# Altium schematic sheet Power Stage.SchDoc
size A
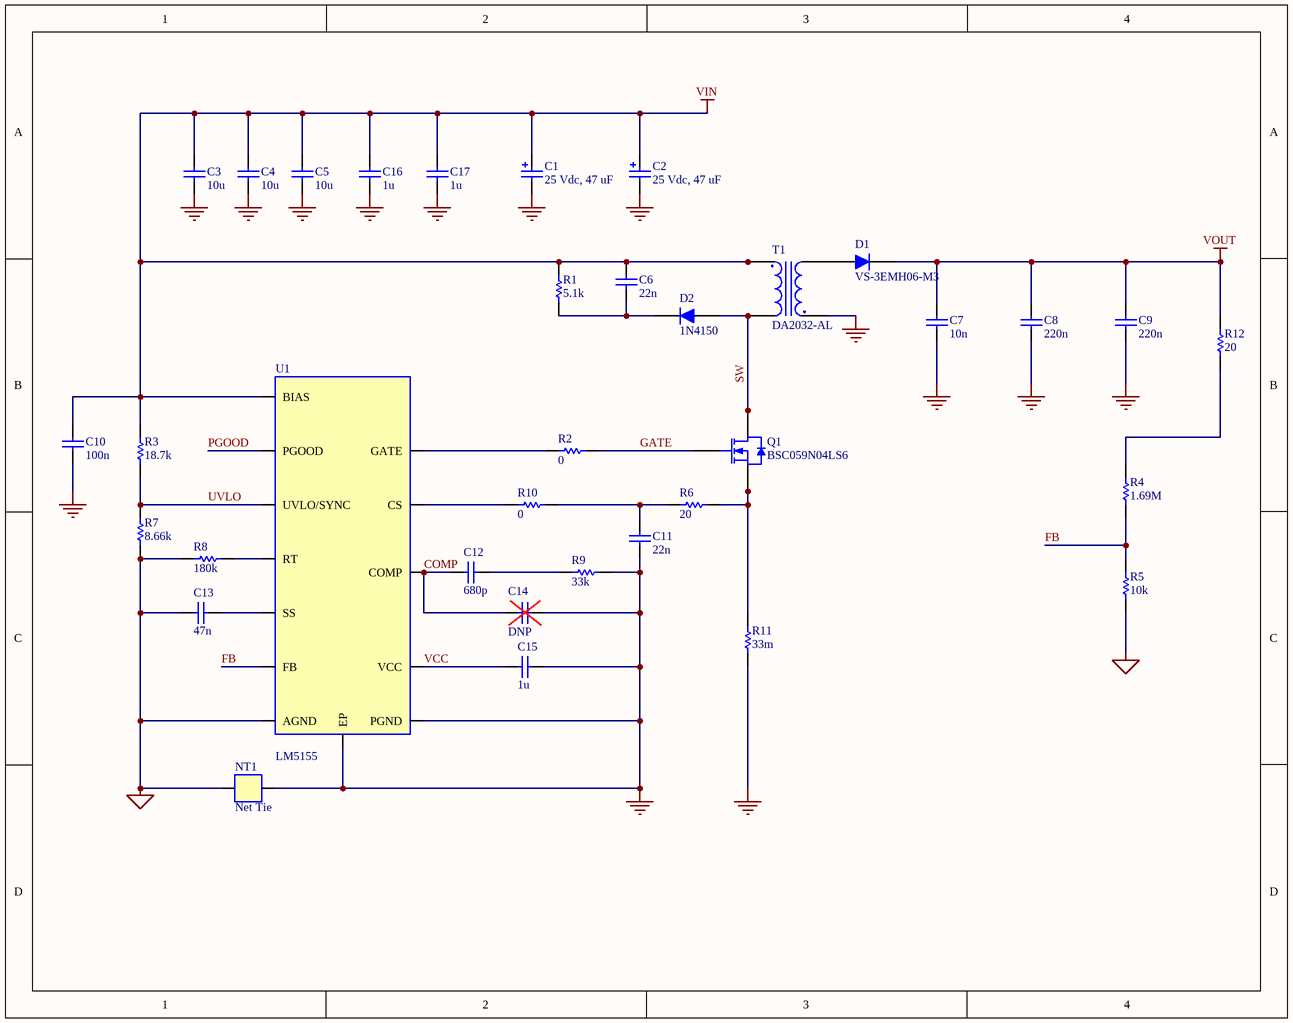
[diagram p0: Power Stage.SchDoc]

## Parts
C1  25 Vdc, 47 uF  [WCAP-PTG5_8x8x3.5]
C2  25 Vdc, 47 uF  [WCAP-PTG5_8x8x3.5]
C3  10u  [CAPC1210(3225)280_N]
C4  10u  [CAPC1210(3225)280_N]
C5  10u  [CAPC1210(3225)280_N]
C6  22n  [CAPC0805(2012)100_M]
C7  10n  [CAPC1206(3216)170_M]
C8  220n  [WIMA 6x12x13]
C9  220n  [WIMA 6x12x13]
C10  100n  [CAPC0603(1608)100_N]
C11  22n  [CAPC0603(1608)100_N]
C12  680p  [CAPC0603(1608)100_M]
C13  47n  [CAPC0603(1608)100_N]
C14  DNP  [CAPC0603(1608)100_M]  (no BOM)
C15  1u  [CAPC0603(1608)100_L]
C16  1u  [CAPC0805(2012)145_N]
C17  1u  [CAPC0805(2012)145_N]
D1  VS-3EMH06-M3  [SMA DO-214AC]
D2  1N4150  [SOD123]
NT1  Net Tie  [NET TIE .25mm]  (net tie, no BOM)
Q1  BSC059N04LS6  [PG-TDSON-8]
R1  5.1k  [RESC1210(3225)_M]
R2  0  [RESC0603(1608)_M]
R3  18.7k  [RESC0603(1608)_N]
R4  1.69M  [RESC0603(1608)_N]
R5  10k  [RESC0603(1608)_N]
R6  20  [RESC0603(1608)_N]
R7  8.66k  [RESC0603(1608)_N]
R8  180k  [RESC0603(1608)_N]
R9  33k  [RESC0603(1608)_M]
R10  0  [RESC0603(1608)_M]
R11  33m  [RESC1206(3216)_N]
R12  20  [RESC0603(1608)_M]
T1  DA2032-AL  [DA2032-AL]
U1  LM5155  [WSON-12]

## Nets
AGND: C13.2 NT1.1 R5.2 R7.1 R8.1 U1.7(AGND)
GND: C1.2(N) C2.2(N) C3.1 C4.1 C5.1 C7.1 C8.1 C9.1 C10.1 C11.1 C14.2 C15.1 C16.1 C17.1 NT1.2 R9.2 R11.1 T1.12 U1.4(PGND) U1.13(EP)
VIN: C1.1(P) C2.1(P) C3.2 C4.2 C5.2 C6.2 C10.2 C16.2 C17.2 R1.2 R3.2 T1.3 T1.4 T1.5 T1.6 U1.1(BIAS)
VOUT: C7.2 C8.2 C9.2 D1.2(K) R12.2
COMP: C12.1 C14.1 U1.6(COMP)
FB: R4.2 R5.1 U1.8(FB)
GATE: Q1.4(GATE) R2.2
PGOOD: U1.11(PGOOD)
SW: D2.1(A) Q1.5(DRAIN) Q1.6(DRAIN) Q1.7(DRAIN) Q1.8(DRAIN) T1.7 T1.8 T1.9 T1.10
UVLO: R3.1 R7.2 U1.12(UVLO/SYNC)
VCC: C15.2 U1.2(VCC)
NetC6_1: C6.1 D2.2(K) R1.1
NetC11_2: C11.2 R6.1 R10.2
NetC12_2: C12.2 R9.1
NetC13_1: C13.1 U1.9(SS)
NetD1_1: D1.1(A) T1.1
NetQ1_1: Q1.1(SOURCE) Q1.2(SOURCE) Q1.3(SOURCE) R6.2 R11.2
NetR2_1: R2.1 U1.3(GATE)
NetR4_1: R4.1 R12.1
NetR8_2: R8.2 U1.10(RT)
NetR10_1: R10.1 U1.5(CS)

## Library data of the parts
C1 C2 = 870025574002: WCAP-PTG5 Aluminum Polymer Capacitors, 8x8mm, 25 Vdc, 47 uF; Rated Voltage: 25 Vdc; Value: 47 uF; ComponentLink1Description: Manufacturer; ComponentLink1URL: http://www.we-online.de; ComponentLink2Description: Datasheet; ComponentLink2URL: http://katalog.we-online.com/pbs/datasheet/870025574002.pdf; Part Number: 870025574002; Published Date: Sep. 2017; Publisher: Wurth Elektronik; Size: 8x8mm; Life Cycle: 2000h; Operating Temperature: -55 °C up to +105 °C; Supplier 1: Digi-Key; Supplier Part Number 1: 732-6324-1-ND; Supplier 2: Mouser; Supplier Part Number 2: 710-870025574002
C3-C5 = CL32B106KBJNNWE: CAP CER 10UF 50V X7R 1210; Manufacturer: Samsung; Tolerance: 10%; Supplier 1: Digi-Key; Manufacturer Part Number: CL32B106KBJNNWE; Stock 1: 279648; Pricing 1: 1=0.69, 10=0.488, 100=0.3214, 500=0.23804 (USD); Mount: Surface Mount; Case/Package: 1210; Case Code (Metric): 3225; Case Code (Imperial): 1210; Min Operating Temperature: -55°C; Max Operating Temperature: 125°C; Capacitance: 10uF; Voltage Rating: 50V; Package Quantity: 1; Packaging: Tape and Reel; Dielectric: X7R; Length: 0.126inch; Width: 0.098inch; Thickness: 0.106inch; Lead Free: Lead Free; ComponentLink1URL: http://www.samsungsem.com/kr/support/product-search/mlcc/CL32B106KBJNNWE.jsp?src-supplier=Digi-Key; ComponentLink1Description: http://www.samsungsem.com/kr/support/product-search/mlcc/CL32B106KBJNNWE.jsp?src-supplier=Digi-Key; Supplier Part Number 1: 1276-3388-1-ND
C6 = CC0805KRX7R0BB223: CAP CER 0.022UF 100V X7R 0805; Manufacturer: Yageo; Capacitance: 22nF; Tolerance: 10%; Supplier 1: Digi-Key; Manufacturer Part Number: CC0805KRX7R0BB223; Stock 1: 2263; Pricing 1: 1=0.13, 10=0.09, 100=0.0425, 500=0.02982, 1000=0.02469 (USD); Mount: Surface Mount; Case/Package: 0805; Min Operating Temperature: -55°C; Max Operating Temperature: 125°C; Dielectric: X7R; Packaging: Tape and Reel; Voltage Rating: 100V; Length: 2mm; Depth: 1.25mm; Width: 1.25mm; Thickness: 0.037inch; ComponentLink1URL: http://documents.rs-components.com/techlib://itc_doclist_GB.htm?stockno=6698886&src-supplier=RSComponents; ComponentLink1Description: http://documents.rs-components.com/techlib://itc_doclist_GB.htm?stockno=6698886&src-supplier=RSComponents; ComponentLink2URL: http://www.farnell.com/datasheets/1447671.pdf?src-supplier=Element14; ComponentLink2Description: http://www.farnell.com/datasheets/1447671.pdf?src-supplier=Element14; Supplier 2: Mouser; Supplier Part Number 1: 311-1473-1-ND; Supplier Part Number 2: 603-CC805KRX7R0BB223; Weight: 0.000194oz; Case Code (Imperial): 0805; Case Code (Metric): 2012; Package Quantity: 1; Voltage Rating (DC): 100V; Termination: SMD/SMT; Composition: Ceramic; Voltage: 100V; Height: 0.85mm; Radiation Hardening: No; REACH SVHC: Unknown; Lead Free: Lead Free; ComponentLink3URL: http://www.yageo.com/documents/recent/UPY-NP0X7R_MV_100-to-630V_9.pdf?src-supplier=Future+Electronics; ComponentLink3Description: http://www.yageo.com/documents/recent/UPY-NP0X7R_MV_100-to-630V_9.pdf?src-supplier=Future+Electronics; ComponentLink4URL: https://www.verical.com/server-webapp/html/getDatasheet?partID=251804&src-supplier=Verical; ComponentLink4Description: https://www.verical.com/server-webapp/html/getDatasheet?partID=251804&src-supplier=Verical; ComponentLink5URL: http://www.yageo.com/documents/recent/UPY-NP0X7R_MV_100-to-630V_21.pdf?src-supplier=Digi-Key; ComponentLink5Description: http://www.yageo.com/documents/recent/UPY-NP0X7R_MV_100-to-630V_21.pdf?src-supplier=Digi-Key; ComponentLink6URL: http://www.yageo.com/documents/recent/UPY-NP0X7R_MV_100-to-630V_9.pdf?src-supplier=Avnet; ComponentLink6Description: http://www.yageo.com/documents/recent/UPY-NP0X7R_MV_100-to-630V_9.pdf?src-supplier=Avnet; Stock 2: 8175; Pricing 2: 1=0.13, 10=0.064, 100=0.029, 1000=0.024, 4000=0.017, 8000=0.017 (USD)
C7 = C3216C0G2E103J115AE: CAP CER 10000PF 250V C0GNP0 1206; Manufacturer: TDK; Supplier 1: Digi-Key; Manufacturer Part Number: C3216C0G2E103J115AE; Stock 1: 9927; Pricing 1: 1=0.54, 10=0.38, 100=0.25, 500=0.18516, 1000=0.15738 (USD); Supplier 2: Mouser; Supplier Part Number 1: 445-180311-1-ND; Supplier Part Number 2: 810-C3216C0G2E103J11
C8 C9 = MKP4F032203G00KSSD: Film Capacitors 250V .22uF 10% PCM10; Manufacturer: WIMA; Voltage Rating (AC): 160V; Capacitance: 220nF; Dielectric: PP; Type: General Purpose; Lead Diameter: 0.6mm; Supplier 1: Mouser; Manufacturer Part Number: MKP4F032203G00KSSD; Stock 1: 4238; Pricing 1: 1=0.7, 10=0.502, 100=0.331, 500=0.245, 1000=0.208, 2500=0.196 (USD); Case/Package: Radial; Min Operating Temperature: -55°C; Max Operating Temperature: 100°C; Voltage Rating: 250V; Voltage Rating (DC): 250V; Tolerance: 10%; Packaging: Bulk; Termination: Radial; Dissipation Factor: 10%; Length: 13mm; Height: 12mm; Width: 6mm; Lead Pitch: 10mm; Depth: 6mm; ComponentLink1URL: http://components.arrow.com/part/dataview/0323_02831910?src-supplier=Arrow+Europe; ComponentLink1Description: http://components.arrow.com/part/dataview/0323_02831910?src-supplier=Arrow+Europe; ComponentLink2URL: http://www.mouser.com/ds/2/440/WIMA_MKP_4-9504.pdf?src-supplier=Mouser; ComponentLink2Description: http://www.mouser.com/ds/2/440/WIMA_MKP_4-9504.pdf?src-supplier=Mouser; Supplier Part Number 1: 505-MKP4.22/250/10
C10 = CC0603JRX7R9BB104: Cap Ceramic 0.1uF 50V X7R 5% SMD 0603 125C Paper T/R; Manufacturer: Yageo; Capacitance: 100nF; Supplier 1: Digi-Key; Manufacturer Part Number: CC0603JRX7R9BB104; Stock 1: 1420595; Pricing 1: 1=0.11, 10=0.08, 100=0.0378, 500=0.02652, 1000=0.02195 (USD); Mount: Surface Mount; Case/Package: 0603; Number of Pins: 2; Weight: 7.1E-05oz; Case Code (Imperial): 0603; Case Code (Metric): 1608; Min Operating Temperature: -55°C; Max Operating Temperature: 125°C; Voltage Rating: 50V; Tolerance: 5%; Packaging: Tape and Reel; Voltage Rating (DC): 50V; Dielectric: X7R; Termination: SMD/SMT; Composition: Ceramic; Length: 1.6mm; Height: 0.8mm; Width: 0.031inch; Thickness: 0.035inch; Depth: 0.8mm; Radiation Hardening: No; Lead Free: Lead Free; Halogen Free: Halogen Free; ComponentLink1URL: http://www.yageo.com/documents/recent/UPY-GPHC_X7R_6.3V-to-50V_8.pdf?src-supplier=Avnet+Europe; ComponentLink1Description: http://www.yageo.com/documents/recent/UPY-GPHC_X7R_6.3V-to-50V_8.pdf?src-supplier=Avnet+Europe; ComponentLink2URL: http://www.yageo.com/documents/recent/UPY-GPHC_X7R_6.3V-to-50V_8.pdf?src-supplier=Avnet; ComponentLink2Description: http://www.yageo.com/documents/recent/UPY-GPHC_X7R_6.3V-to-50V_8.pdf?src-supplier=Avnet; Supplier 2: Mouser; Supplier Part Number 2: 603-CC603JRX7R9BB104; Supplier Part Number 1: 311-1779-1-ND
C11 = C0603C223K4RACTU: Cap Ceramic 0.022uF 16V X7R 10% SMD 0603 125°C Paper T/R; Manufacturer: KEMET; Capacitance: 22nF; Supplier 1: Digi-Key; Manufacturer Part Number: C0603C223K4RACTU; Stock 1: 100470; Pricing 1: 1=0.1, 10=0.07, 100=0.031, 500=0.02214, 1000=0.01739 (USD); Mount: Surface Mount; Case/Package: 0603; Case Code (Metric): 1608; Case Code (Imperial): 0603; Min Operating Temperature: -55°C; Max Operating Temperature: 125°C; Packaging: Tape and Reel; Package Quantity: 1; Voltage Rating: 16V; Tolerance: 10%; Voltage Rating (DC): 16V; Dielectric: X7R; Termination: SMD/SMT; Length: 1.6mm; Height: 0.8mm; Width: 0.8mm; Thickness: 0.034inch; REACH SVHC: No SVHC; ComponentLink1URL: https://search.kemet.com/component-edge/download/datasheet/C0603C223K4RACTU.pdf?src-supplier=Allied+Electronics; ComponentLink1Description: https://search.kemet.com/component-edge/download/datasheet/C0603C223K4RACTU.pdf?src-supplier=Allied+Electronics; ComponentLink2URL: http://www.jameco.com/Jameco/Products/ProdDS/1636924.pdf?src-supplier=Jameco; ComponentLink2Description: http://www.jameco.com/Jameco/Products/ProdDS/1636924.pdf?src-supplier=Jameco; Supplier 2: Mouser; Stock 2: 254178; Pricing 2: 1=0.1, 10=0.032, 100=0.022, 500=0.019, 1000=0.015, 4000=0.011 (USD); Supplier Part Number 2: 80-C0603C223K4R; Supplier Part Number 1: 399-1093-1-ND; Weight: 7.1E-05oz; Depth: 0.8mm; Radiation Hardening: No; ComponentLink3URL: https://www.verical.com/server-webapp/html/getDatasheet?partID=724406&src-supplier=Verical; ComponentLink3Description: https://www.verical.com/server-webapp/html/getDatasheet?partID=724406&src-supplier=Verical
C12 = 885012006013: Cap, Mlcc, C0g, 680Pf, 10V, 0603; Manufacturer: Wurth Electronics; Tolerance: 5%; Supplier 1: Digi-Key; Manufacturer Part Number: 885012006013; Stock 1: 4565; Pricing 1: 1=0.1, 10=0.056, 100=0.0506, 500=0.04476 (USD); Mount: Surface Mount; Case/Package: 0603; Case Code (Imperial): 0603; Case Code (Metric): 1608; Min Operating Temperature: -55°C; Max Operating Temperature: 125°C; Capacitance: 680pF; Voltage Rating: 10V; Packaging: Tape and Reel; Length: 0.063inch; Width: 0.031inch; Thickness: 0.034inch; ComponentLink1URL: https://katalog.we-online.de/pbs/datasheet/885012006013.pdf?src-supplier=Digi-Key; ComponentLink1Description: https://katalog.we-online.de/pbs/datasheet/885012006013.pdf?src-supplier=Digi-Key; ComponentLink2URL: http://www.farnell.com/datasheets/2546580.pdf?src-supplier=Farnell; ComponentLink2Description: http://www.farnell.com/datasheets/2546580.pdf?src-supplier=Farnell; Supplier 2: Mouser; Stock 2: 3118; Pricing 2: 1=0.1, 10=0.057, 25=0.057, 50=0.057, 100=0.051, 250=0.051 (USD); Supplier Part Number 1: 732-7757-1-ND; Supplier Part Number 2: 710-885012006013
C13 = CC0603KRX7R9BB473: CAP CER 0.047UF 50V X7R 0603; Manufacturer: Yageo; Capacitance: 47nF; Tolerance: 10%; Supplier 1: Digi-Key; Manufacturer Part Number: CC0603KRX7R9BB473; Stock 1: 536094; Pricing 1: 1=0.1, 10=0.052, 100=0.0234, 500=0.0167, 1000=0.01312 (USD); Mount: Surface Mount; Case/Package: 0603; Case Code (Metric): 1608; Case Code (Imperial): 0603; Min Operating Temperature: -55°C; Max Operating Temperature: 125°C; Package Quantity: 1; Voltage Rating: 50V; Packaging: Tape and Reel; Voltage Rating (DC): 50V; Dielectric: X7R; Termination: SMD/SMT; Composition: Ceramic; Voltage: 50V; Length: 1.6mm; Height: 0.8mm; Width: 0.031inch; Thickness: 0.035inch; Depth: 0.8mm; Radiation Hardening: No; REACH SVHC: Unknown; Lead Free: Lead Free; Halogen Free: Halogen Free; ComponentLink1URL: http://www.yageo.com/documents/recent/UPY-GPHC_X7R_6.3V-to-50V_18.pdf?src-supplier=Digi-Key; ComponentLink1Description: http://www.yageo.com/documents/recent/UPY-GPHC_X7R_6.3V-to-50V_18.pdf?src-supplier=Digi-Key; ComponentLink2URL: http://www.yageo.com/exep/pages/download/literatures/ProductSelectionGuide%202014_Final_2.pdf?src-supplier=Digi-Key; ComponentLink2Description: http://www.yageo.com/exep/pages/download/literatures/ProductSelectionGuide%202014_Final_2.pdf?src-supplier=Digi-Key; ComponentLink3URL: http://documents.rs-components.com/techlib://itc_doclist_GB.htm?stockno=6698811&src-supplier=RSComponents; ComponentLink3Description: http://documents.rs-components.com/techlib://itc_doclist_GB.htm?stockno=6698811&src-supplier=RSComponents; ComponentLink4URL: http://www.farnell.com/datasheets/1489800.pdf?src-supplier=Element14; ComponentLink4Description: http://www.farnell.com/datasheets/1489800.pdf?src-supplier=Element14; ComponentLink5URL: https://www.verical.com/server-webapp/html/getDatasheet?partID=403593&src-supplier=Verical; ComponentLink5Description: https://www.verical.com/server-webapp/html/getDatasheet?partID=403593&src-supplier=Verical; Supplier 2: Mouser; Supplier Part Number 1: 311-1427-1-ND; Supplier Part Number 2: 603-C0603KRX7R9BB473
C14 = 0603 DNP JUMPER
C15 = CL10B105MO8NNWC: CAP CER 1UF 16V X7R 0603; Manufacturer: Samsung Electro-Mechanics; Tolerance: ±20%; Notification: Current market demand for these product types have resulted in fluctuating and extending lead times. Lead times may differ.; Supplier 1: Digi-Key; Manufacturer Part Number: CL10B105MO8NNWC; RoHS: RoHS Compliant; Category: Capacitors; Stock 1: 40000; Pricing 1: 1=0.1, 10=0.043, 100=0.0194, 500=0.01406, 1000=0.01121 (USD); Packaging: Cut Tape (CT); Part Status: Active; Voltage - Rated: 16V; Temperature Coefficient: X7R; Operating Temperature: -55°C ~ 125°C; Features: -; Ratings: -; Applications: General Purpose; Mounting Type: Surface Mount, MLCC; Package / Case: 0603 (1608 Metric); Size / Dimension: 0.063" L x 0.031" W (1.60mm x 0.80mm); Height - Seated (Max): -; Thickness (Max): 0.035" (0.90mm); Lead Spacing: -; Lead Style: -; ComponentLink1URL: http://www.samsungsem.com/kr/support/product-search/mlcc/CL10B105MO8NNWC.jsp; ComponentLink1Description: http://www.samsungsem.com/kr/support/product-search/mlcc/CL10B105MO8NNWC.jsp; Supplier Part Number 1: 1276-6524-1-ND
C16 C17 = CC0805KKX7R9BB105: Cap Ceramic 1uF 50V X7R 10% SMD 0805 125C Blister T/R; Manufacturer: Yageo; Supplier 1: Digi-Key; Manufacturer Part Number: CC0805KKX7R9BB105; Stock 1: 558291; Pricing 1: 1=0.27, 10=0.188, 100=0.1064, 500=0.0751, 1000=0.06571 (USD); Mount: Surface Mount; Case/Package: 0805; Weight: 0.000194oz; Case Code (Imperial): 0805; Case Code (Metric): 2012; Min Operating Temperature: -55°C; Max Operating Temperature: 125°C; Tolerance: 10%; Packaging: Tape and Reel; Capacitance: 1uF; Voltage Rating: 50V; Voltage Rating (DC): 50V; Dielectric: X7R; Termination: SMD/SMT; Composition: Ceramic; Length: 2mm; Height: 1.25mm; Width: 0.049inch; Thickness: 0.057inch; Depth: 1.25mm; Radiation Hardening: No; Lead Free: Lead Free; Halogen Free: Halogen Free; ComponentLink1URL: http://www.mouser.com/ds/2/447/Yageo_UPY-GP_NP0_16V-to-50V_9-358835.pdf?src-supplier=Mouser; ComponentLink1Description: http://www.mouser.com/ds/2/447/Yageo_UPY-GP_NP0_16V-to-50V_9-358835.pdf?src-supplier=Mouser; Supplier 2: Mouser; Supplier Part Number 2: 603-CC805KKX7R9BB105; Supplier Part Number 1: 311-1886-1-ND
D1 = VS-3EMH06-M3/5AT: Rectifiers 3 Amp 600 Volts Hyperfast - Low QRR; Manufacturer: Vishay Semiconductors; Element Configuration: Single; Reverse Recovery Time: 25ns; Peak Reverse Current: 3uA; Recovery Time: 35ns; Max Surge Current: 50A; Average Rectified Current: 3A; Reverse Voltage: 600V; Supplier 1: Mouser; Manufacturer Part Number: VS-3EMH06-M3/5AT; Stock 1: 8913; Pricing 1: 1=0.46, 10=0.359, 100=0.26, 500=0.213, 1000=0.164, 2500=0.149 (USD); Mount: Surface Mount; Min Operating Temperature: -55°C; Max Operating Temperature: 175°C; Packaging: Tape and Reel; Package Quantity: 7500; Max Reverse Voltage (DC): 600V; ComponentLink1URL: http://www.mouser.com/ds/2/427/vs-3emh06-m3-254202.pdf?src-supplier=Mouser; ComponentLink1Description: http://www.mouser.com/ds/2/427/vs-3emh06-m3-254202.pdf?src-supplier=Mouser; Supplier Part Number 1: 78-VS-3EMH06-M3/5AT
D2 = 1N4150W-E3-08: DIODE GEN PURP 50V 200MA SOD123; Manufacturer: Vishay Semiconductors; Recovery Time: 4ns; Max Power Dissipation: 410mW; Max Reverse Leakage Current: 100nA; Element Configuration: Single; Supplier 1: Mouser; Manufacturer Part Number: 1N4150W-E3-08; Stock 1: 24139; Pricing 1: 1=0.26, 10=0.177, 100=0.092, 500=0.074, 1000=0.049, 3000=0.042, 6000=0.037, 9000=0.032, 24000=0.028 (USD); Mount: Surface Mount; Weight: 0.000363oz; Min Operating Temperature: -55°C; Max Operating Temperature: 150°C; Packaging: Tape and Reel; Forward Current: 200mA; Package Quantity: 3000; Average Rectified Current: 200mA; Reverse Recovery Time: 4ns; Max Repetitive Reverse Voltage (Vrrm): 50V; Max Reverse Voltage (DC): 50V; Radiation Hardening: No; ComponentLink1URL: http://www.vishay.com/docs/85720/1n4150wv.pdf?src-supplier=Avnet; ComponentLink1Description: http://www.vishay.com/docs/85720/1n4150wv.pdf?src-supplier=Avnet; Supplier 2: Digi-Key; Supplier Part Number 1: 78-1N4150W-E3-08; Supplier Part Number 2: 1N4150W-E3-08CT-ND
Q1 = BSC059N04LS6ATMA1: MOSFET N-CH 40V 59A; Manufacturer: Infineon; Supplier 1: Digi-Key; Manufacturer Part Number: BSC059N04LS6ATMA1; Stock 1: 5451; Pricing 1: 1=0.89, 10=0.8, 25=0.7592, 100=0.5693, 250=0.56388, 500=0.48256, 1000=0.3931, 2500=0.38767 (USD); Supplier 2: Mouser; Stock 2: 13444; Pricing 2: 1=0.89, 10=0.759, 100=0.583, 500=0.516, 1000=0.407, 2500=0.361 (USD); Supplier Part Number 1: BSC059N04LS6ATMA1CT-ND; Supplier Part Number 2: 726-BSC059N04LS6ATMA
R1 = ERJ-14YJ512U: RES SMD 5.1K OHM 5% 1/2W 1210; Manufacturer: Panasonic; Resistance: 5.1kR; Power Rating: 500mW; Voltage Rating: 200V; Temperature Coefficient: 200ppm/°C; Supplier 1: Digi-Key; Manufacturer Part Number: ERJ-14YJ512U; Stock 1: 25383; Pricing 1: 1=0.15, 10=0.125, 100=0.0487, 1000=0.02039, 2500=0.0187 (USD); Case/Package: 1210; Case Code (Metric): 3225; Case Code (Imperial): 1210; Min Operating Temperature: -55°C; Max Operating Temperature: 155°C; Tolerance: 5%; Packaging: Tape and Reel; Voltage Rating (DC): 200V; Composition: Thick Film; Termination: SMD/SMT; Military Standard: Not; Package Quantity: 1; Number of Terminations: 2; Max Power Dissipation: 500mW; Features: Automotive AEC-Q200; Length: 3.2mm; Height: 0.028inch; Width: 0.098inch; Depth: 2.5mm; Lead Free: Lead Free; ComponentLink1URL: http://industrial.panasonic.com/www-data/pdf/AOA0000/AOA0000CE1.pdf?src-supplier=Avnet; ComponentLink1Description: http://industrial.panasonic.com/www-data/pdf/AOA0000/AOA0000CE1.pdf?src-supplier=Avnet; Supplier 2: Mouser; Supplier Part Number 2: 667-ERJ-14YJ512U; Supplier Part Number 1: P5.1KVCT-ND; Mount: Surface Mount; Contact Plating: Tin; Radiation Hardening: No; Weight: 0.000564oz; ComponentLink2URL: http://industrial.panasonic.com/www-data/pdf/AOA0000/AOA0000CE1.pdf?src-supplier=Avnet+Europe; ComponentLink2Description: http://industrial.panasonic.com/www-data/pdf/AOA0000/AOA0000CE1.pdf?src-supplier=Avnet+Europe
R2 R10 = RC0603FR-070RL: RES SMD 0 OHM JUMPER 1/10W 0603; Manufacturer: Yageo; Power (Watts): 0.1W, 1/10W; Supplier 1: Digi-Key; Manufacturer Part Number: RC0603FR-070RL; RoHS: RoHS Compliant; Category: Resistors; Stock 1: 150; Pricing 1: 1=0.1, 10=0.024, 25=0.0172, 50=0.013, 100=0.0096, 250=0.00732, 500=0.00586, 1000=0.00431 (USD); Packaging: Cut Tape (CT); Part Status: Active; Tolerance: Jumper; Composition: Thick Film; Features: Moisture Resistant; Temperature Coefficient: -; Operating Temperature: -55°C ~ 155°C; Package / Case: 0603 (1608 Metric); Supplier Device Package: 0603; Size / Dimension: 0.063" L x 0.032" W (1.60mm x 0.80mm); Height - Seated (Max): 0.022" (0.55mm); Failure Rate: -; ComponentLink1URL: http://www.yageo.com/documents/recent/PYu-RC_Group_51_RoHS_L_9.pdf; ComponentLink1Description: http://www.yageo.com/documents/recent/PYu-RC_Group_51_RoHS_L_9.pdf; Supplier Part Number 1: 311-0.0HRCT-ND
R3 = RC0603FR-0718K7L: RC Series 0603 0.1 W 18.7 kOhms 1% ±100 ppm/°C SMT Thick Film Chip Resistor; Manufacturer: Yageo; Resistance: 18.7kR; Power Rating: 100mW; Voltage Rating: 50V; Supplier 1: Digi-Key; Manufacturer Part Number: RC0603FR-0718K7L; Stock 1: 272173; Pricing 1: 1=0.1, 10=0.023, 100=0.0094, 1000=0.00421, 2500=0.00366 (USD); Case/Package: 0603; Case Code (Imperial): 0603; Case Code (Metric): 1608; Min Operating Temperature: -55°C; Max Operating Temperature: 155°C; Tolerance: 1%; Packaging: Tape and Reel; Package Quantity: 5000; Termination: SMD/SMT; Composition: Thick Film; Military Standard: Not; Temperature Coefficient: 100ppm/°C; Voltage Rating (DC): 50V; Length: 1.6mm; Height: 0.45mm; Width: 0.8mm; Depth: 0.8mm; Lead Free: Lead Free; ComponentLink1URL: http://www.mouser.com/catalog/specsheets/RC0603.pdf?src-supplier=Mouser; ComponentLink1Description: http://www.mouser.com/catalog/specsheets/RC0603.pdf?src-supplier=Mouser; Supplier 2: Mouser; Stock 2: 12272; Pricing 2: 1=0.1, 10=0.018, 100=0.006, 1000=0.005, 5000=0.003, 10000=0.003 (USD); Supplier Part Number 1: 311-18.7KHRCT-ND; Supplier Part Number 2: 603-RC0603FR-0718K7L
R4 = RC0603FR-071M69L: Res Thick Film 0603 1.69M Ohm 1% 1/10W 100ppm/C Molded SMD Paper T/R; Manufacturer: Yageo; Resistance: 1.69MR; Temperature Coefficient: 100ppm/°C; Power Rating: 100mW; Voltage Rating: 50V; Supplier 1: Mouser; Manufacturer Part Number: RC0603FR-071M69L; Stock 1: 62863; Pricing 1: 1=0.1, 10=0.009, 100=0.003, 1000=0.003, 5000=0.002, 10000=0.002 (USD); Case/Package: 0603; Contact Plating: Tin,Matte; Case Code (Imperial): 0603; Case Code (Metric): 1608; Min Operating Temperature: -55°C; Max Operating Temperature: 155°C; Tolerance: 1%; Composition: Thick Film; Packaging: Tape and Reel; Termination: SMD/SMT; Number of Terminations: 2; Military Standard: Not; Max Power Dissipation: 100mW; Features: Moisture Resistant; Length: 1.6mm; Height: 0.022inch; Width: 0.8mm; Depth: 0.8mm; ComponentLink1URL: http://www.yageo.com/documents/recent/PYu-RC0603_51_RoHS_L_4.pdf?src-supplier=Avnet+Europe; ComponentLink1Description: http://www.yageo.com/documents/recent/PYu-RC0603_51_RoHS_L_4.pdf?src-supplier=Avnet+Europe; Supplier 2: Digi-Key; Supplier Part Number 1: 603-RC0603FR-071M69L; Supplier Part Number 2: RC0603FR-071M69L-ND
R5 = RC0603FR-0710KL: RES SMD 10K OHM 1% 1/10W 0603; Manufacturer: Yageo; Power (Watts): 0.1W, 1/10W; Temperature Coefficient: ±100ppm/°C; Supplier 1: Digi-Key; Manufacturer Part Number: RC0603FR-0710KL; RoHS: RoHS Compliant; Category: Resistors; Stock 1: 0; Pricing 1: 1=0.1, 10=0.024, 100=0.0097, 1000=0.00436, 2500=0.00378 (USD); Packaging: Cut Tape (CT); Part Status: Active; Tolerance: ±1%; Composition: Thick Film; Features: Moisture Resistant; Operating Temperature: -55°C ~ 155°C; Package / Case: 0603 (1608 Metric); Supplier Device Package: 0603; Size / Dimension: 0.063" L x 0.032" W (1.60mm x 0.80mm); Height - Seated (Max): 0.022" (0.55mm); Failure Rate: -; ComponentLink1URL: http://www.yageo.com/documents/recent/PYu-RC_Group_51_RoHS_L_9.pdf; ComponentLink1Description: http://www.yageo.com/documents/recent/PYu-RC_Group_51_RoHS_L_9.pdf; Supplier Part Number 1: 311-10.0KHRCT-ND
R6 R12 = RC0603FR-0720RL: RES SMD 20 OHM 1% 1/10W 0603; Manufacturer: Yageo; Power (Watts): 0.1W, 1/10W; Temperature Coefficient: ±100ppm/°C; Supplier 1: Digi-Key; Manufacturer Part Number: RC0603FR-0720RL; RoHS: RoHS Compliant; Category: Resistors; Stock 1: 0; Pricing 1: 1=0.1, 10=0.024, 100=0.0097, 1000=0.00436, 2500=0.00378 (USD); Packaging: Cut Tape (CT); Part Status: Active; Tolerance: ±1%; Composition: Thick Film; Features: Moisture Resistant; Operating Temperature: -55°C ~ 155°C; Package / Case: 0603 (1608 Metric); Supplier Device Package: 0603; Size / Dimension: 0.063" L x 0.032" W (1.60mm x 0.80mm); Height - Seated (Max): 0.022" (0.55mm); Failure Rate: -; ComponentLink1URL: http://www.yageo.com/documents/recent/PYu-RC_Group_51_RoHS_L_9.pdf; ComponentLink1Description: http://www.yageo.com/documents/recent/PYu-RC_Group_51_RoHS_L_9.pdf; Supplier Part Number 1: 311-20.0HRCT-ND
R7 = RC0603FR-078K66L: Res Thick Film 0603 8.66K Ohm 1% 0.1W(1/10W) ±100ppm/C Epoxy Pad SMD T/R; Manufacturer: Yageo; Resistance: 8.66kR; Power Rating: 100mW; Voltage Rating: 75V; Temperature Coefficient: 100ppm/°C; Voltage Rating (DC): 50V; Supplier 1: Digi-Key; Manufacturer Part Number: RC0603FR-078K66L; Stock 1: 116662; Pricing 1: 1=0.1, 10=0.023, 100=0.0094, 1000=0.00421, 2500=0.00366 (USD); Case/Package: 0603; Weight: 7.1E-05oz; Case Code (Metric): 1608; Case Code (Imperial): 0603; Min Operating Temperature: -55°C; Max Operating Temperature: 155°C; Tolerance: 1%; Package Quantity: 1; Packaging: Tape and Reel; Composition: Thick Film; Number of Terminations: 2; Termination: SMD/SMT; Military Standard: Not; Max Power Dissipation: 100mW; Features: Moisture Resistant; Length: 1.6mm; Height: 0.022inch; Width: 0.031inch; Depth: 0.8mm; Lead Free: Lead Free; ComponentLink1URL: http://www.yageo.com/documents/recent/PYu-RC_Group_51_RoHS_L_9.pdf?src-supplier=Digi-Key; ComponentLink1Description: http://www.yageo.com/documents/recent/PYu-RC_Group_51_RoHS_L_9.pdf?src-supplier=Digi-Key; ComponentLink2URL: http://www.yageo.com/documents/recent/PYu-RC_Group_51_RoHS_L_10.pdf?src-supplier=Digi-Key; ComponentLink2Description: http://www.yageo.com/documents/recent/PYu-RC_Group_51_RoHS_L_10.pdf?src-supplier=Digi-Key; Supplier 2: Mouser; Stock 2: 7267; Pricing 2: 1=0.1, 10=0.018, 100=0.006, 1000=0.005, 5000=0.003, 10000=0.003 (USD); Supplier Part Number 1: 311-8.66KHRCT-ND; Supplier Part Number 2: 603-RC0603FR-078K66L
R8 = RC0603FR-07180KL: RES SMD 180K OHM 1% 1/10W 0603; Manufacturer: Yageo; Resistance: 180kR; Power Rating: 100mW; Voltage Rating: 50V; Temperature Coefficient: 100ppm/°C; Working Voltage: 75V; Supplier 1: Digi-Key; Manufacturer Part Number: RC0603FR-07180KL; Stock 1: 1461910; Pricing 1: 1=0.1, 10=0.024, 100=0.0097, 1000=0.00437, 2500=0.00379 (USD); Case/Package: 0603; Case Code (Metric): 1608; Case Code (Imperial): 0603; Min Operating Temperature: -55°C; Max Operating Temperature: 155°C; Tolerance: 1%; Packaging: Tape and Reel; Composition: Thick Film; Termination: SMD/SMT; Voltage Rating (DC): 50V; Package Quantity: 1; Number of Terminations: 2; Max Power Dissipation: 100mW; Features: Moisture Resistant; Length: 1.6mm; Height: 0.45mm; Width: 0.8mm; Depth: 0.8mm; Lead Free: Lead Free; ComponentLink1URL: http://www.mouser.com/catalog/specsheets/RC0603.pdf?src-supplier=Mouser; ComponentLink1Description: http://www.mouser.com/catalog/specsheets/RC0603.pdf?src-supplier=Mouser; ComponentLink2URL: http://www.farnell.com/datasheets/1868787.pdf?src-supplier=Element14; ComponentLink2Description: http://www.farnell.com/datasheets/1868787.pdf?src-supplier=Element14; ComponentLink3URL: http://documents.rs-components.com/techlib://itc_doclist_GB.htm?stockno=5049965&src-supplier=RSComponents; ComponentLink3Description: http://documents.rs-components.com/techlib://itc_doclist_GB.htm?stockno=5049965&src-supplier=RSComponents; Supplier 2: Mouser; Supplier Part Number 2: 603-RC0603FR-07180KL; Supplier Part Number 1: 311-180KHRCT-ND; Number of Pins: 2; REACH SVHC: Unknown; Military Standard: Not; ComponentLink4URL: http://www.yageo.com/documents/recent/PYu-RC_Group_51_RoHS_L_10.pdf?src-supplier=Digi-Key; ComponentLink4Description: http://www.yageo.com/documents/recent/PYu-RC_Group_51_RoHS_L_10.pdf?src-supplier=Digi-Key
R9 = RC0603FR-0733KL: YAGEO - RC0603FR-0733KL - Surface Mount Thick Film Resistor, RC Series, 33 kohm, 100 mW, - 1%, 50 V, 0603 [1608 Metric] RoHS Compliant: Yes; Voltage Rating (DC): 50V; Resistance: 33kR; Temperature Coefficient: 100ppm/°C; Power Rating: 100mW; Supplier 1: Digi-Key; Manufacturer: Yageo; Manufacturer Part Number: RC0603FR-0733KL; Stock 1: 3226219; Pricing 1: 1=0.1, 10=0.023, 100=0.0094, 1000=0.00421, 2500=0.00366 (USD); Case/Package: 0603; Number of Pins: 2; Case Code (Metric): 1608; Case Code (Imperial): 0603; Min Operating Temperature: -55°C; Max Operating Temperature: 155°C; Tolerance: 1%; Packaging: Tape and Reel; Composition: Thick Film; Voltage Rating: 50V; Package Quantity: 1; Number of Terminations: 2; Termination: SMD/SMT; Military Standard: Not; Max Power Dissipation: 100mW; Features: Moisture Resistant; Length: 0.063inch; Height: 0.022inch; Width: 0.031inch; Depth: 0.8mm; REACH SVHC: No SVHC; Lead Free: Lead Free; ComponentLink1URL: http://www.yageo.com/documents/recent/PYu-RC_Group_51_RoHS_L_10.pdf?src-supplier=Digi-Key; ComponentLink1Description: http://www.yageo.com/documents/recent/PYu-RC_Group_51_RoHS_L_10.pdf?src-supplier=Digi-Key; ComponentLink2URL: https://www.verical.com/server-webapp/html/getDatasheet?partID=353493&src-supplier=Verical; ComponentLink2Description: https://www.verical.com/server-webapp/html/getDatasheet?partID=353493&src-supplier=Verical; Supplier 2: Mouser; Stock 2: 471285; Pricing 2: 1=0.1, 10=0.018, 100=0.006, 1000=0.005, 5000=0.003, 10000=0.003 (USD); Supplier Part Number 1: 311-33.0KHRCT-ND; Supplier Part Number 2: 603-RC0603FR-0733KL; ComponentLink3URL: http://www.farnell.com/datasheets/1868787.pdf?src-supplier=Element14; ComponentLink3Description: http://www.farnell.com/datasheets/1868787.pdf?src-supplier=Element14; ComponentLink4URL: http://www.farnell.com/datasheets/2167052.pdf?src-supplier=Element14; ComponentLink4Description: http://www.farnell.com/datasheets/2167052.pdf?src-supplier=Element14; ComponentLink5URL: http://www.farnell.com/datasheets/443971.pdf?src-supplier=Element14; ComponentLink5Description: http://www.farnell.com/datasheets/443971.pdf?src-supplier=Element14
R11 = KRL1632E-M-R033-F-T5: TR / Current Sense Resistors 1206 0.75W 0.033ohm 1% 50ppm; Manufacturer: Susumu; Resistance: 33mR; Power Rating: 750mW; Temperature Coefficient: 50ppm/°C; Supplier 1: Digi-Key; Manufacturer Part Number: KRL1632E-M-R033-F-T5; Stock 1: 20615; Pricing 1: 1=0.54, 10=0.385, 25=0.3004, 50=0.2542, 100=0.2002, 250=0.1694, 500=0.1386, 1000=0.1078 (USD); Case/Package: Metal; Weight: 0.000466oz; Case Code (Metric): 1632; Case Code (Imperial): 0612; Min Operating Temperature: -55°C; Max Operating Temperature: 155°C; Packaging: Tape and Reel; Tolerance: 1%; Termination: SMD/SMT; Composition: Metal Foil; Length: 3.2mm; Height: 0.5mm; Width: 1.6mm; Lead Free: Lead Free; ComponentLink1URL: http://www.mouser.com/ds/2/392/KRL_New_Short_Data_sheet-1115627.pdf?src-supplier=Mouser; ComponentLink1Description: http://www.mouser.com/ds/2/392/KRL_New_Short_Data_sheet-1115627.pdf?src-supplier=Mouser; Supplier 2: Mouser; Stock 2: 4925; Pricing 2: 1=0.54, 10=0.254, 100=0.169, 500=0.138, 1000=0.107, 2500=0.107 (USD); Supplier Part Number 1: 408-1576-1-ND; Supplier Part Number 2: 754-KRL1632EMR033FT5
T1 = DA2032-ALD: COILCRAFT - DA2032-ALD - TRANSFORMATOR, FLYBACK, LT3750, SMD; Resistance: 0.013R; Turns Ratio: 1:10; Inductance: 10uH; DC Resistance (DCR): 1.6R; Isolation Voltage: 1.5kV; Shielding: Shielded; Current Rating: 3A; Supplier 1: Mouser; Manufacturer: Coilcraft; Manufacturer Part Number: DA2032-ALD; Stock 1: 2584; Pricing 1: 1=4.5, 10=4.05, 50=3.6, 100=3.15, 200=2.84, 400=2.61 (USD); Min Operating Temperature: -40°C; Max Operating Temperature: 125°C; Termination: SMD/SMT; Packaging: Tape and Reel; Max DC Current: 3A; Package Quantity: 200; Length: 17.2mm; Height: 8.89mm; Width: 14.98mm; Lead Free: Contains Lead; REACH SVHC: Unknown; ComponentLink1URL: http://www.farnell.com/datasheets/1870438.pdf?src-supplier=Element14; ComponentLink1Description: http://www.farnell.com/datasheets/1870438.pdf?src-supplier=Element14; ComponentLink2URL: http://www.farnell.com/datasheets/1870438.pdf?src-supplier=Farnell; ComponentLink2Description: http://www.farnell.com/datasheets/1870438.pdf?src-supplier=Farnell; ComponentLink3URL: http://www.mouser.com/ds/2/597/da2032-463371.pdf?src-supplier=Mouser; ComponentLink3Description: http://www.mouser.com/ds/2/597/da2032-463371.pdf?src-supplier=Mouser; Supplier Part Number 1: 994-DA2032-ALD
U1 = LM5155DSSR: 2.2MHz wide VIN non-synchronous boost controller 12-WSON -40 to 125; Manufacturer: Texas Instruments; Supplier 1: Digi-Key; Manufacturer Part Number: LM5155DSSR; Stock 1: 2695; Pricing 1: 1=1.95, 10=1.749, 25=1.65, 100=1.32, 250=1.155, 500=1.122, 1000=0.891 (USD); Supplier 2: Mouser; Stock 2: 2933; Pricing 2: 1=1.94, 10=1.65, 100=1.32, 500=1.15, 1000=0.957, 3000=0.891, 6000=0.858, 9000=0.825 (USD); Supplier Part Number 1: 296-LM5155DSSRCT-ND; Supplier Part Number 2: 595-LM5155DSSR